# Altium schematic sheet etna-main-pmic.SchDoc
size A4; DocumentNumber: 1; SheetNumber: 2; SheetTotal: 5; PageSetup: Record=PageOptions|CenterHorizontal=True|CenterVertical=True|PrintScale=0.73|XCorrection=1.00|YCorrection=1.00|PrintKind=1|BorderSize=5000000|LeftOffset=0|BottomOffset=0|Orientation=2|PaperLength=1000|PaperWidth=1000|Scale=100|PaperSource=15|PrintQuality=1200|MediaType=1|DitherType=10|PaperKind=A4|PrintScaleMode=1
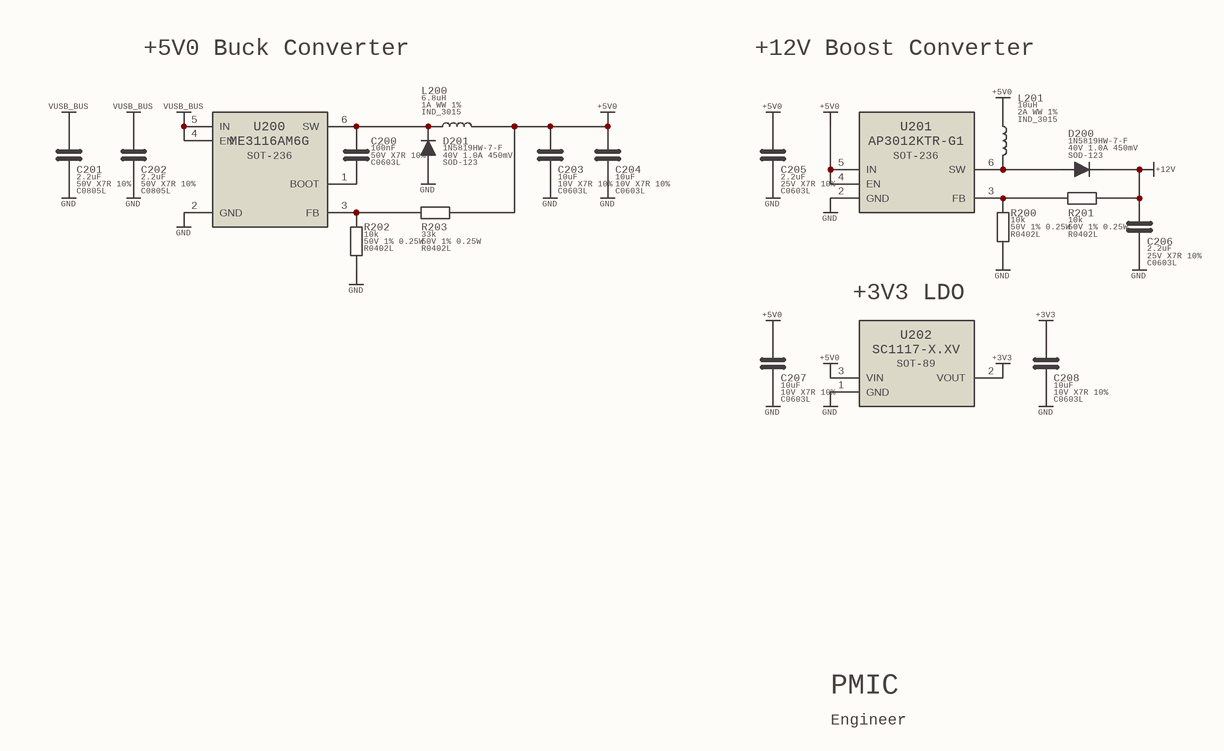
[diagram p0: etna-main-pmic.SchDoc]

## Parts
C200  value 100nF  Specification: 50V X7R 10%  [C0603L]  (hidden comment: 100n)
C201  value 2.2uF  Specification: 50V X7R 10%  [C0805L]  (hidden comment: 100n)
C202  value 2.2uF  Specification: 50V X7R 10%  [C0805L]  (hidden comment: 100n)
C203  value 10uF  Specification: 10V X7R 10%  [C0603L]  (hidden comment: 100n)
C204  value 10uF  Specification: 10V X7R 10%  [C0603L]  (hidden comment: 100n)
C205  value 2.2uF  Specification: 25V X7R 10%  [C0603L]  (hidden comment: 100n)
C206  value 2.2uF  Specification: 25V X7R 10%  [C0603L]  (hidden comment: 100n)
C207  value 10uF  Specification: 10V X7R 10%  [C0603L]  (hidden comment: 100n)
C208  value 10uF  Specification: 10V X7R 10%  [C0603L]  (hidden comment: 100n)
D200  value 1N5819HW-7-F  Specification: 40V 1.0A 450mV  [SOD-123]  (hidden comment: DIODE)
D201  value 1N5819HW-7-F  Specification: 40V 1.0A 450mV  [SOD-123]  (hidden comment: DIODE)
L200  value 6.8uH  Specification: 1A WW 1%  [IND_3015]  (hidden comment: INDUCTOR)
L201  value 10uH  Specification: 2A WW 1%  [IND_3015]  (hidden comment: INDUCTOR)
R200  value 10k  Specification: 50V 1% 0.25W  [R0402L]
R201  value 10k  Specification: 50V 1% 0.25W  [R0402L]
R202  value 10k  Specification: 50V 1% 0.25W  [R0402L]
R203  value 33k  Specification: 50V 1% 0.25W  [R0402L]
U200  ME3116AM6G  [SOT-236]
U201  AP3012KTR-G1  [SOT-236]
U202  SC1117-X.XV  [SOT-89]

## Nets
+3V3: C208.1 U202.2(VOUT)
+5V0: C203.1 C204.1 C205.1 C207.1 L200.2 L201.1 R203.1 U201.4(EN) U201.5(IN) U202.3(VIN)
+12V: C206.1 D200.2(K) R201.2
GND: C201.2 C202.2 C203.2 C204.2 C205.2 C206.2 C207.2 C208.2 D201.1(A) R200.2 R202.2 U200.2(GND) U201.2(GND) U202.1(GND)
VUSB_BUS: C201.1 C202.1 U200.4(EN) U200.5(IN)
NetC200_1: C200.1 D201.2(K) L200.1 U200.6(SW)
NetC200_2: C200.2 U200.1(BOOT)
NetD200_1: D200.1(A) L201.2 U201.6(SW)
NetR200_1: R200.1 R201.1 U201.3(FB)
NetR202_1: R202.1 R203.2 U200.3(FB)

Not connected (* = marked no-connect by the designer): U200 44(N.C.); U201 44(N.C.); U202 44(N.C.)

## Notes on the sheet
- +5V0 Buck Converter
- +12V Boost Converter
- +3V3 LDO
- PMIC
- Engineer

## Library data of the parts
C200-C208 = CAPACITOR_NONPOL
R200-R203 = RESISTOR
U200 = LMR14006: Value: ME3116AM6G
U201 = AP3012KTR-G1: Value: AP3012KTR-G1
U202 = SC1117-X.XV: Value: SC1117-X.XV